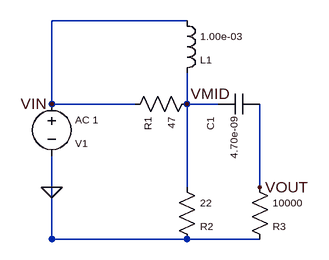
[diagram p0: schematic second_order_circuit.asc]
second_order_circuit.asc, the LTspice schematic file:
Version 4
SHEET 1 1096 1096
WIRE 100 564 100 612
WIRE 100 484 228 484
WIRE 308 484 356 484
WIRE 100 484 100 356
WIRE 100 356 308 356
WIRE 308 436 308 484
WIRE 308 484 308 612
WIRE 308 692 100 692
WIRE 420 484 420 612
WIRE 420 692 100 692
WIRE 100 692 100 612
FLAG 100 484 VIN
FLAG 308 484 VMID
FLAG 420 612 VOUT
SYMBOL voltage 100 468 R0
SYMATTR InstName V1
WINDOW 0 36 76 Left 1
SYMATTR Value AC 1
WINDOW 3 36 40 Left 1
FLAG 100 612 0
SYMBOL res 324 468 R90
SYMATTR InstName R1
WINDOW 0 36 76 Left 1
SYMATTR Value 47
WINDOW 3 36 40 Left 1
SYMBOL ind 292 340 R0
SYMATTR InstName L1
WINDOW 0 36 76 Left 1
SYMATTR Value 1.00e-03
WINDOW 3 36 40 Left 1
SYMBOL res 292 596 R0
SYMATTR InstName R2
WINDOW 0 36 76 Left 1
SYMATTR Value 22
WINDOW 3 36 40 Left 1
SYMBOL cap 420 468 R90
SYMATTR InstName C1
WINDOW 0 36 76 Left 1
SYMATTR Value 4.70e-09
WINDOW 3 36 40 Left 1
SYMBOL res 404 596 R0
SYMATTR InstName R3
WINDOW 0 36 76 Left 1
SYMATTR Value 10000
WINDOW 3 36 40 Left 1

The netlist it stands for:
* second_order_circuit.asc
V1 VIN 0 AC 1
R1 VMID VIN 47
L1 VIN VMID 1.00e-03
R2 VMID 0 22
C1 VOUT VMID 4.70e-09
R3 VOUT 0 10000
.backanno
.end